# EAGLE schematic MCP32008LCD (EAGLE 7.3.0)
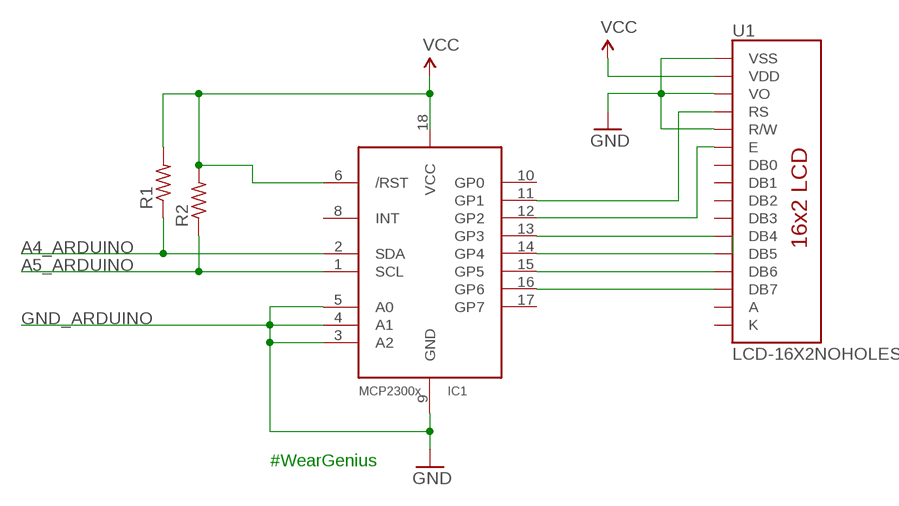
[diagram p0: schematic, sheet 1]

## Parts
IC1  MCP23008/P  [DIL18]
R1  R-US_0204/2V  [0204V]
R2  R-US_0204/2V  [0204V]
U1  LCD-16X2NOHOLES  [LCD-16X2_NOHOLES]

## Nets
A4_ARDUINO: IC1.2(SDA) R1.1
A5_ARDUINO: IC1.1(SCL) R2.1
GND: U1.1(VSS) U1.3(VO) U1.5(R/W)
GND_ARDUINO: IC1.3(A2) IC1.4(A1) IC1.5(A0) IC1.9(GND) ; supply symbol labelled GND
N$1: IC1.15(GP5) U1.13(DB6)
N$2: IC1.14(GP4) U1.12(DB5)
N$3: IC1.13(GP3) U1.11(DB4)
N$4: IC1.11(GP1) U1.4(RS)
N$5: IC1.12(GP2) U1.6(E)
N$10: IC1.16(GP6) U1.14(DB7)
VCC: IC1.6(/RST) R1.2 R2.2 U1.2(VDD)
Unconnected: IC1.8(INT) IC1.10(GP0) IC1.17(GP7) U1.7(DB0) U1.8(DB1) U1.9(DB2) U1.10(DB3)

## Notes on the sheet
- #WearGenius

## Power pins joined to a net without a drawn wire
A: U1.15(A)
K: U1.16(K)
VCC: IC1.18(VCC)

## Library data of the parts
IC1 = adafruit:MCP23008: MCP23008 Inexpensive i2c i/o expander - 8 general purpose i/o pins with optional pullups
R1 R2 = adafruit:R-US_: RESISTOR, American symbol
U1 = SparkFun-Displays:LCD-16X2: Standard text-only 16x2 parallel input LCD